# EAGLE design aqc-rev2-front-panel (EAGLE 8.3.1)
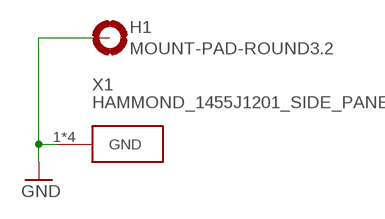
[diagram p0: schematic, sheet 1]

## Parts
H1  MOUNT-PAD-ROUND3.2  [3,2-PAD]
X1  HAMMOND_1455J1201_SIDE_PANEL  [HAMMOND_1455J1201_SIDE_PANEL]

## Nets
GND: H1.B3,2(MOUNT) X1.1(GND) X1.2(GND) X1.3(GND) X1.4(GND)

## Library data of the parts
H1 = holes:MOUNT-PAD-ROUND: MOUNTING PAD, round
X1 = meng:HAMMOND_1455J1201_SIDE_PANEL

## Board
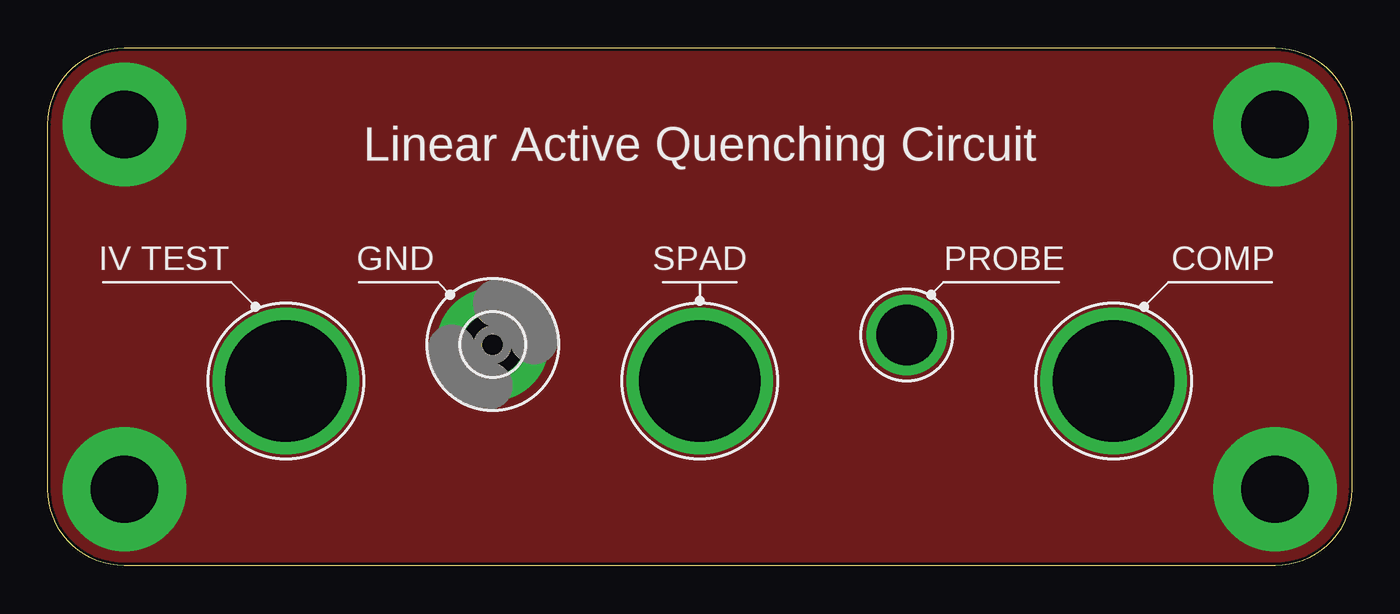
[diagram p1: board, top side]
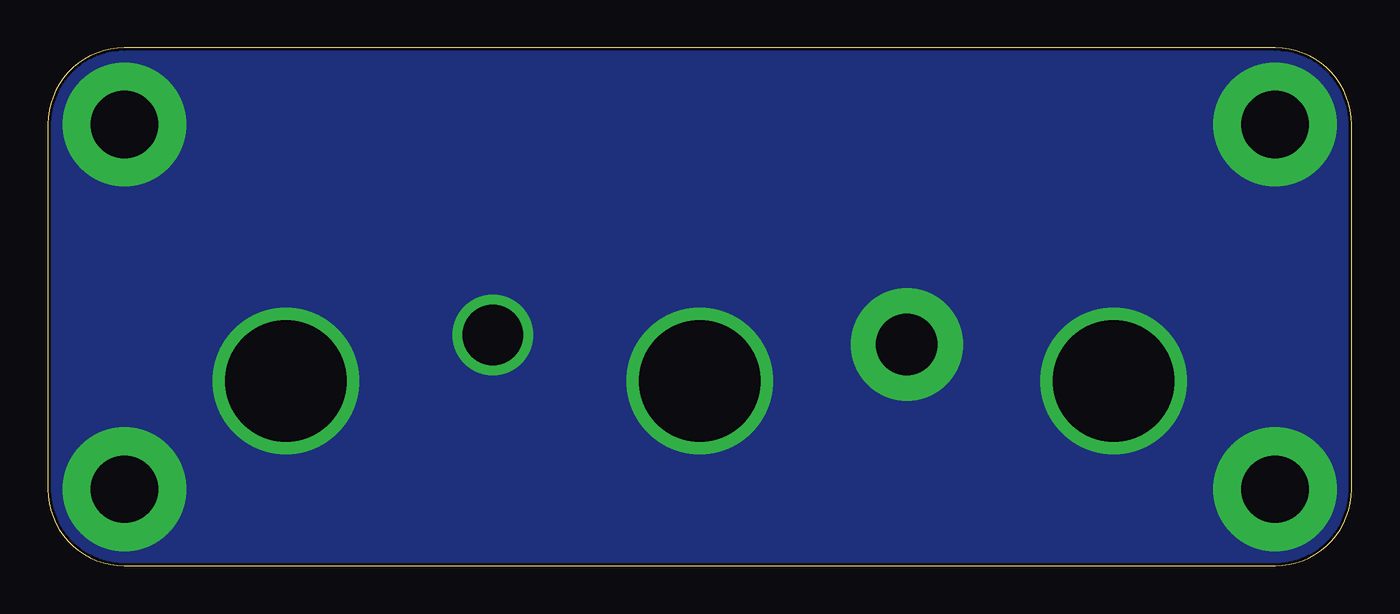
[diagram p2: board, bottom side, seen from below]

Size 68 x 27 mm. Coordinates in mm from the lower left corner, seen from the top.
Copper layers (1*16): Top 0.035mm / dielectric 1.5mm / Bottom 0.035mm
Design rules "default *": minimum track width 6mil, minimum drill 0.35mm, track to track 6mil, track to pad 6mil, pad to pad 6mil, via to via 6mil, smd to smd 6mil, copper to edge 6mil, drill to drill 6mil, minimum pad ring 10mil, minimum via ring 8mil, stop-mask expansion 4mil, vias tented up to drill 0mil, thermal gap 10mil

### Footprints (pad centres in the part's own frame; a part is rotated, then mirrored left to right if it is on the bottom)
3,2-PAD = drill 3.2 pad 5.842: B3,2 0,0
HAMMOND_1455J1201_SIDE_PANEL = drill 3.5 pad 6.452: 1 -30.01,-9.51; 2 30.01,-9.51; 3 30.01,9.51; 4 -30.01,9.51

### Placement (x,y rotation side)
H1  23.2,11.54 0 top
X1  34,13.5 0 top

### Tracks (layer width: path | path; a pad name or v marks a point on that pad's centre or on a via)
GND  (via drill 3.17, 6.35 pad 7.62)
  other vias: 12.41,9.63 34,9.63 55.59,9.63 44.8,12.03
  pour Bottom (no thermals): -0.29,27.47 -0.29,-0.47 68.29,-0.47 68.29,27.47
  pour Top (no thermals): -0.29,27.47 -0.29,-0.47 68.29,-0.47 68.29,27.47

### Text on the board
tNames: Linear Active Quenching Circuit | IV TEST | GND | SPAD | PROBE | COMP